# Altium project KM_BD01.PrjPcb
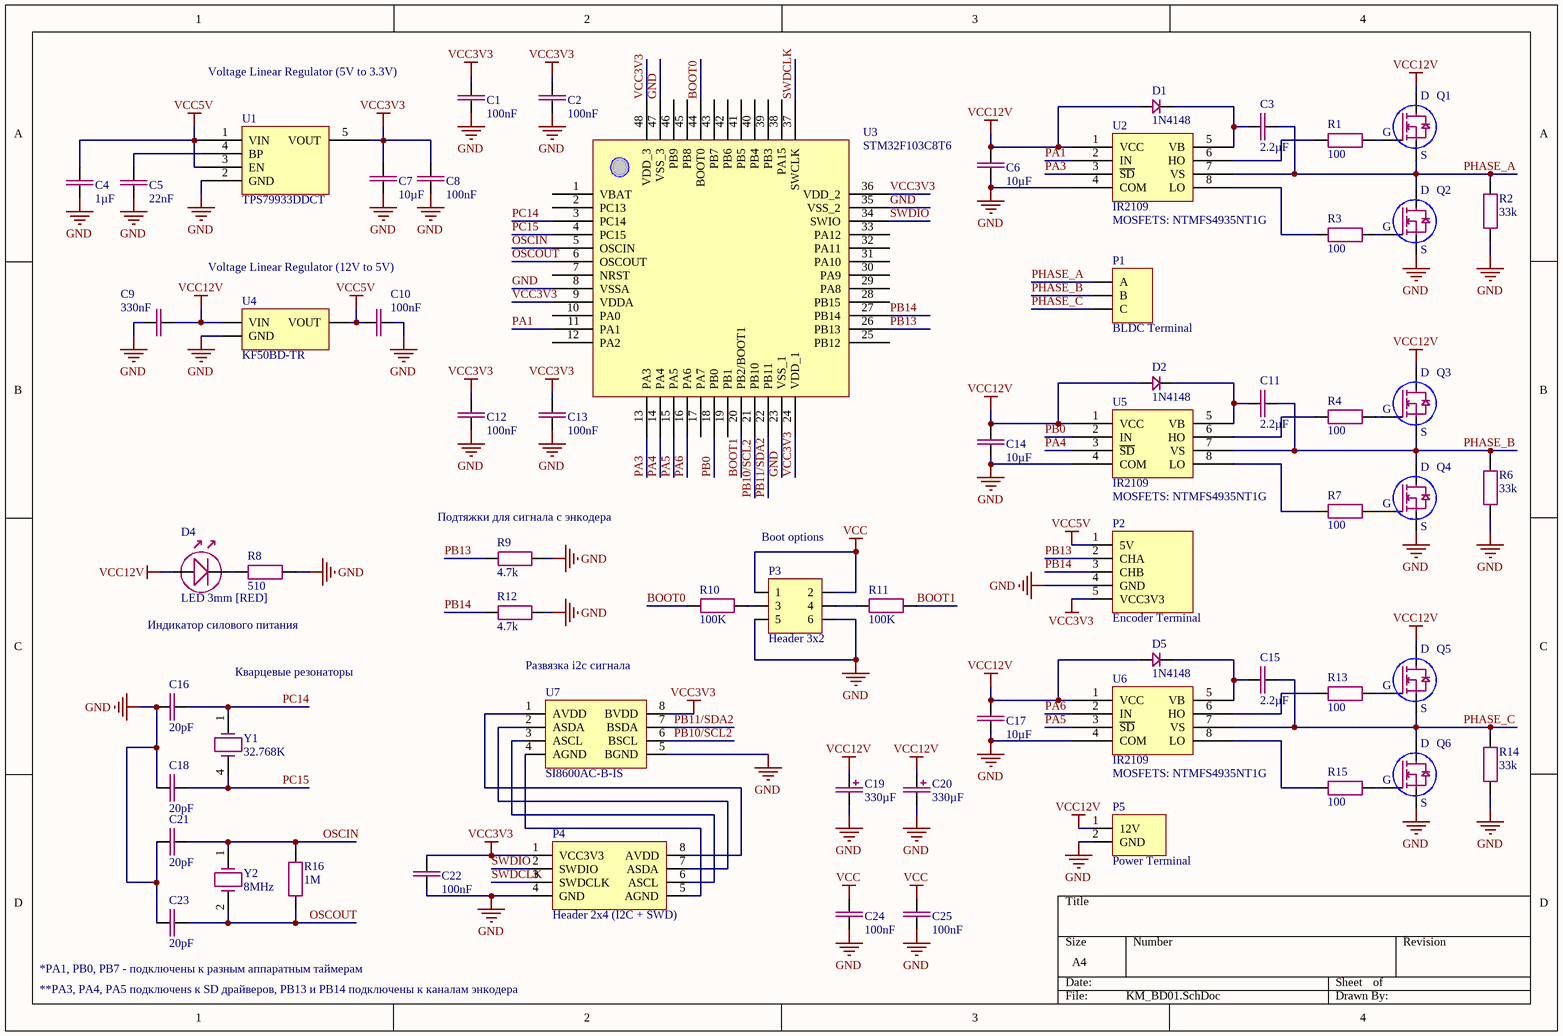
[diagram p0: KM_BD01.SchDoc]
2 sheets, 64 parts. Net scope: global (net labels, ports and power ports of the same name join across sheets).
Board files: KM_BD01.PcbDoc, PowerCell.PcbDoc
Sheets:
  KM_BD01.SchDoc
  PowerCell.SchDoc

## Sheet KM_BD01.SchDoc
size A4

### Parts
C1  100nF  [SMD 1206 CAP]
C2  100nF  [SMD 1206 CAP]
C3  2.2µF  [SMD 1206 CAP]
C4  1µF  [SMD 1206 CAP]
C5  22nF  [SMD 1206 CAP]
C6  10µF  [SMD 1206 CAP]
C7  10µF  [SMD 1206 CAP]
C8  100nF  [SMD 1206 CAP]
C9  330nF  [SMD 1206 CAP]
C10  100nF  [SMD 1206 CAP]
C11  2.2µF  [SMD 1206 CAP]
C12  100nF  [SMD 1206 CAP]
C13  100nF  [SMD 1206 CAP]
C14  10µF  [SMD 1206 CAP]
C15  2.2µF  [SMD 1206 CAP]
C16  20pF  [SMD 1206 CAP]
C17  10µF  [SMD 1206 CAP]
C18  20pF  [SMD 1206 CAP]
C19  330µF  [THD 6.3x11 CAP]
C20  330µF  [THD 6.3x11 CAP]
C21  20pF  [SMD 1206 CAP]
C22  100nF  [SMD 1206 CAP]
C23  20pF  [SMD 1206 CAP]
C24  100nF  [SMD 1206 CAP]
C25  100nF  [SMD 1206 CAP]
D1  1N4148  [DO-35]
D2  1N4148  [DO-35]
D4  LED 3mm [RED]  [LED 3mm RED]
D5  1N4148  [DO-35]
P1  BLDC Terminal  [Universal 3-Phase Terminal]
P2  Encoder Terminal  [PLS_5]
P3  Header 3x2  [PLS_3x2 (Without legs)]
P4  Header 2x4 (I2C + SWD)  [PLS_4x2]
P5  Power Terminal  [Universal Power Terminal]
Q1  NTMFS4935NT1G  [SO-8FL]  (value not drawn)
Q2  NTMFS4935NT1G  [SO-8FL]  (value not drawn)
Q3  NTMFS4935NT1G  [SO-8FL]  (value not drawn)
Q4  NTMFS4935NT1G  [SO-8FL]  (value not drawn)
Q5  NTMFS4935NT1G  [SO-8FL]  (value not drawn)
Q6  NTMFS4935NT1G  [SO-8FL]  (value not drawn)
R1  100  [SMD 1206 RES]
R2  33k  [SMD 1206 RES]
R3  100  [SMD 1206 RES]
R4  100  [SMD 1206 RES]
R6  33k  [SMD 1206 RES]
R7  100  [SMD 1206 RES]
R8  510  [SMD 1206 RES]
R9  4.7k  [SMD 1206 RES]
R10  100K  [SMD 1206 RES]
R11  100K  [SMD 1206 RES]
R12  4.7k  [SMD 1206 RES]
R13  100  [SMD 1206 RES]
R14  33k  [SMD 1206 RES]
R15  100  [SMD 1206 RES]
R16  1M  [SMD 1206 RES]
U1  TPS79933DDCT  [SOT95P245X110-5N]
U2  IR2109  [SOIC-8]
U3  STM32F103C8T6  [TQFP-48]
U4  KF50BD-TR  [SOIC-8 (KF50BD-TR)]
U5  IR2109  [SOIC-8]
U6  IR2109  [SOIC-8]
U7  SI8600AC-B-IS  [SOIC-8]
Y1  32.768K  [SMD 0803-8P4]
Y2  8MHz  [HC-49SM]

### Nets
GND: C1.1 C2.1 C4.1 C5.1 C6.1 C7.1 C8.1 C9.1 C10.2 C12.1 C13.1 C14.1 C16.1 C17.1 C18.1 C19.2 C20.2 C21.1 C22.1 C23.1 C24.1 C25.1 P2.4(GND) P3.5 P3.6 P4.4(GND) P5.2(GND) Q2.2(S) Q4.2(S) Q6.2(S) R2.1 R6.1 R8.2 R9.1 R12.1 R14.1 U1.2(GND) U2.4(COM) U3.8(VSSA) U3.23(VSS_1) U3.35(VSS_2) U3.47(VSS_3) U4.2(GND) U5.4(COM) U6.4(COM) U7.5(BGND)
VCC: C24.2 C25.2 P3.1 P3.2
VCC3V3: C1.2 C2.2 C7.2 C8.2 C12.2 C13.2 C22.2 P2.5(VCC3V3) P4.1(VCC3V3) U1.5(VOUT) U3.9(VDDA) U3.24(VDD_1) U3.36(VDD_2) U3.48(VDD_3) U7.8(BVDD)
VCC5V: C4.2 C10.1 P2.1(5V) U1.1(VIN) U1.3(EN) U4.1(VOUT)
VCC12V: C6.2 C9.2 C14.2 C17.2 C19.1 C20.1 D1.1 D2.1 D4.1 D5.1 P5.1(12V) Q1.3(D) Q3.3(D) Q5.3(D) U2.1(VCC) U4.5(VIN) U5.1(VCC) U6.1(VCC)
BOOT0: R10.1 U3.44(BOOT0)
BOOT1: R11.2 U3.20(PB2/BOOT1)
OSCIN: C21.2 R16.2 U3.5(OSCIN) Y2.1
OSCOUT: C23.2 R16.1 U3.6(OSCOUT) Y2.2
PA1: U2.2(IN) U3.11(PA1)
PA3: U2.3(~{SD}) U3.13(PA3)
PA4: U3.14(PA4) U5.3(~{SD})
PA5: U3.15(PA5) U6.3(~{SD})
PA6: U3.16(PA6) U6.2(IN)
PB0: U3.18(PB0) U5.2(IN)
PB10/SCL2: U3.21(PB10) U7.6(BSCL)
PB11/SDA2: U3.22(PB11) U7.7(BSDA)
PB13: P2.2(CHA) R9.2 U3.26(PB13)
PB14: P2.3(CHB) R12.2 U3.27(PB14)
PC14: C16.2 U3.3(PC14) Y1.1
PC15: C18.2 U3.4(PC15) Y1.4
PHASE_A: C3.2 P1.1(A) Q1.2(S) Q2.3(D) R2.2 U2.7(VS)
PHASE_B: C11.2 P1.2(B) Q3.2(S) Q4.3(D) R6.2 U5.7(VS)
PHASE_C: C15.2 P1.3(C) Q5.2(S) Q6.3(D) R14.2 U6.7(VS)
SWDCLK: P4.3(SWDCLK) U3.37(SWCLK)
SWDIO: P4.2(SWDIO) U3.34(SWIO)
NetC3_1: C3.1 D1.2 U2.5(VB)
NetC5_2: C5.2 U1.4(BP)
NetC11_1: C11.1 D2.2 U5.5(VB)
NetC15_1: C15.1 D5.2 U6.5(VB)
NetD4_2: D4.2 R8.1
NetP3_3: P3.3 R10.2
NetP3_4: P3.4 R11.1
NetP4_5: P4.5(AGND) U7.4(AGND)
NetP4_6: P4.6(ASCL) U7.3(ASCL)
NetP4_7: P4.7(ASDA) U7.2(ASDA)
NetP4_8: P4.8(AVDD) U7.1(AVDD)
NetQ1_1: Q1.1(G) R1.2
NetQ2_1: Q2.1(G) R3.2
NetQ3_1: Q3.1(G) R4.2
NetQ4_1: Q4.1(G) R7.2
NetQ5_1: Q5.1(G) R13.2
NetQ6_1: Q6.1(G) R15.2
NetR1_1: R1.1 U2.6(HO)
NetR3_1: R3.1 U2.8(LO)
NetR4_1: R4.1 U5.6(HO)
NetR7_1: R7.1 U5.8(LO)
NetR13_1: R13.1 U6.6(HO)
NetR15_1: R15.1 U6.8(LO)

Not connected (* = marked no-connect by the designer): U3 1(VBAT) 2(PC13) 7(NRST) 10(PA0) 12(PA2) 17(PA7) 19(PB1) 25(PB12) 28(PB15) 29(PA8) 30(PA9) 31(PA10) 32(PA11) 33(PA12) 38(PA15) 39(PB3) 40(PB4) 41(PB5) 42(PB6) 43(PB7) 45(PB8) 46(PB9)

### Notes on the sheet
- Voltage Linear Regulator (5V to 3.3V)
- (near U2) MOSFETS: NTMFS4935NT1G
- Voltage Linear Regulator (12V to 5V)
- (near R9) Подтяжки для сигнала с энкодера
- MOSFETS: NTMFS4935NT1G
- Boot options
- Индикатор силового питания
- Кварцевые резонаторы
- Развязка i2c сигнала
- (near U6) MOSFETS: NTMFS4935NT1G
- (near C23) *PA1, PB0, PB7 - подключены к разным аппаратным таймерам
- **PA3, PA4, PA5 подключенs к SD драйверов, PB13 и PB14 подключены к каналам энкодера

### Library data of the parts
C1 C2 C8 C10 C12 C13 C22 C24 C25 = 100nF: Capacitor 100nF [104]
C3 C11 C15 = 2.2µF: Capacitor 2.2µF [205]
C4 = 1µF: Capacitor 1µF [105]
C5 = 22nF: Capacitor 22nF [223]
C6 C7 C14 C17 = 10µF: Capacitor 10µF [106]
C9 = 330nF: Capacitor 330nF [334]
C16 C18 C21 C23 = 20pF: Capacitor 20pF
C19 C20 = 330µF: Capacitor 330µF [336]
D1 D2 D5 = 1N4148: Fast diode
P1 = BLDC Terminal: 3-pad terminal
P2 = Encoder Terminal: 5-pin PLS terminal
P3 = Header 3x2: 6-pin PLS terminal
P4 = Header 2x4 (I2C + SWD): 8-pin PLS terminal
P5 = Power Terminal: 12V 2-pad terminal
Q1-Q6 = NTMFS4935NT1G: Mosfet [OptiMOS]
R1 R3 R4 R7 R13 R15 = 100: Resistor
R2 R6 R14 = 33k: Resistor
R8 = 510: Resistor
R9 R12 = 4.7k: Resistor
R10 R11 = 100K: Resistor
R16 = 1M: Resistor
U1 = TPS79933DDCT: Linear Voltage Regulator (3.3V)
U2 U5 U6 = IR2109: Fast Half-Bridge Driver
U3 = STM32F103C8T6: Microcontroller
U4 = KF50BD-TR: Linear Voltage Regulator (5V)
U7 = SI8600AC-B-IS: Bidirectional I2C isolator
Y1 = 32.768K: Oscillator
Y2 = 8MHz: Oscillator

## Sheet PowerCell.SchDoc
size A4